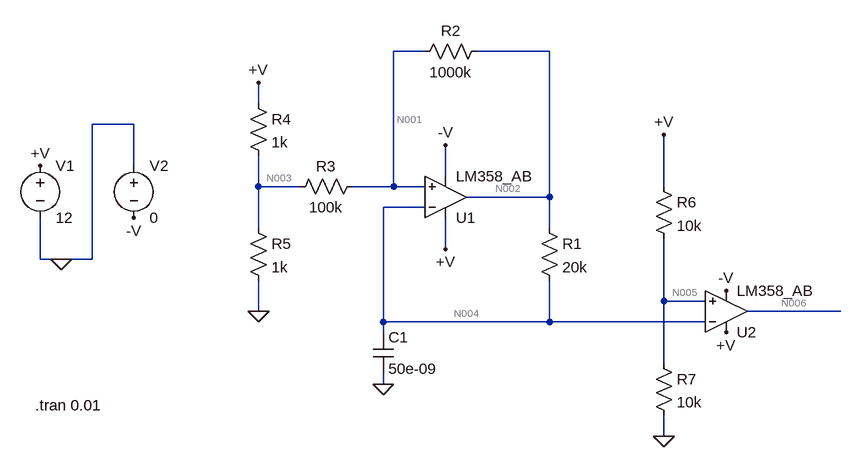
[diagram p0: schematic ШИМ.asc]
* ШИМ.asc
V1 +V 0 12
V2 0 -V 0
R1 N002 N004 20k
C1 N004 0 50e-09
R2 N002 N001 1000k
R3 N001 N003 100k
R4 +V N003 1k
R5 N003 0 1k
* U1: LM358_AB (symbol ZZZ\OpAmp\LM358_AB not available, pins judged from their places): In+=N001 In-=N004 V+=+V V-=-V OUT=N002
* U2: LM358_AB (symbol ZZZ\OpAmp\LM358_AB not available, pins judged from their places): In+=N005 In-=N004 V+=+V V-=-V OUT=N006
R6 +V N005 10k
R7 N005 0 10k
.tran 0.01
.backanno
.end

* Results of the author's LTspice run, read from the files saved beside the schematic
* Operating Point, zero values left out:
*   V(+v) = 12 V
*   V(n002) = 6.003 V
*   V(n004) = 6.004 V
*   V(n001) = 6.005 V
*   V(n003) = 6 V
*   V(n005) = 6 V
*   V(n006) = 21.76 µV
*   I(R7) = 600 µA
*   I(R6) = 600 µA
*   I(R5) = 6 mA
*   I(R4) = 6 mA
*   I(R3) = 45.47 nA
*   I(R2) = -2.007 nA
*   I(R1) = -96.44 nA
*   I(V2) = -666.2 µA
*   I(V1) = -7.266 mA
*   Ix(u1:IN+) = -47.48 nA
*   Ix(u1:IN-) = -48.87 nA
*   Ix(u1:VCC) = 357.8 µA
*   Ix(u1:VSS) = -357.8 µA
*   Ix(u1:OUT) = 98.45 nA
*   Ix(u2:IN+) = -48.79 nA
*   Ix(u2:IN-) = -47.57 nA
*   Ix(u2:VCC) = 308.5 µA
*   Ix(u2:VSS) = -308.4 µA
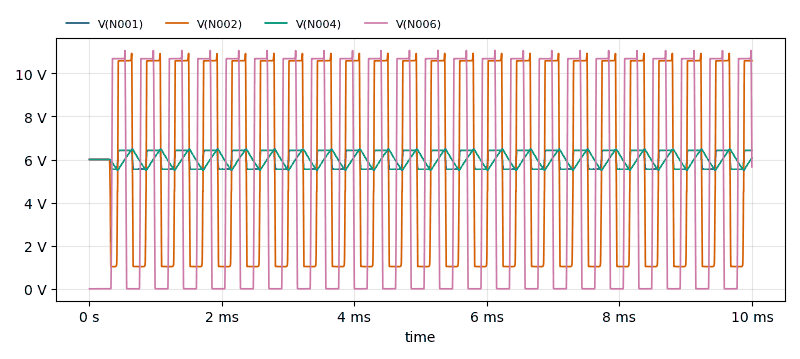
[diagram p1: Transient Analysis of ШИМ.asc, plotted from the saved traces]
* Transient Analysis, 1 run:
*   V(N001): min 5.552 V, max 6.455 V, average 6.004 V, rms 6.018 V, last 6.421 V
*   V(N002): min 1.027 V, max 10.93 V, average 5.997 V, rms 7.526 V, last 10.59 V
*   V(N004): min 5.51 V, max 6.482 V, average 5.99 V, rms 5.997 V, last 6.076 V
*   V(N006): min 21.76 µV, max 11.07 V, average 5.209 V, rms 7.347 V, last 5.655 V